# EAGLE design snarfbasebasics232-v02 (EAGLE 5.11)
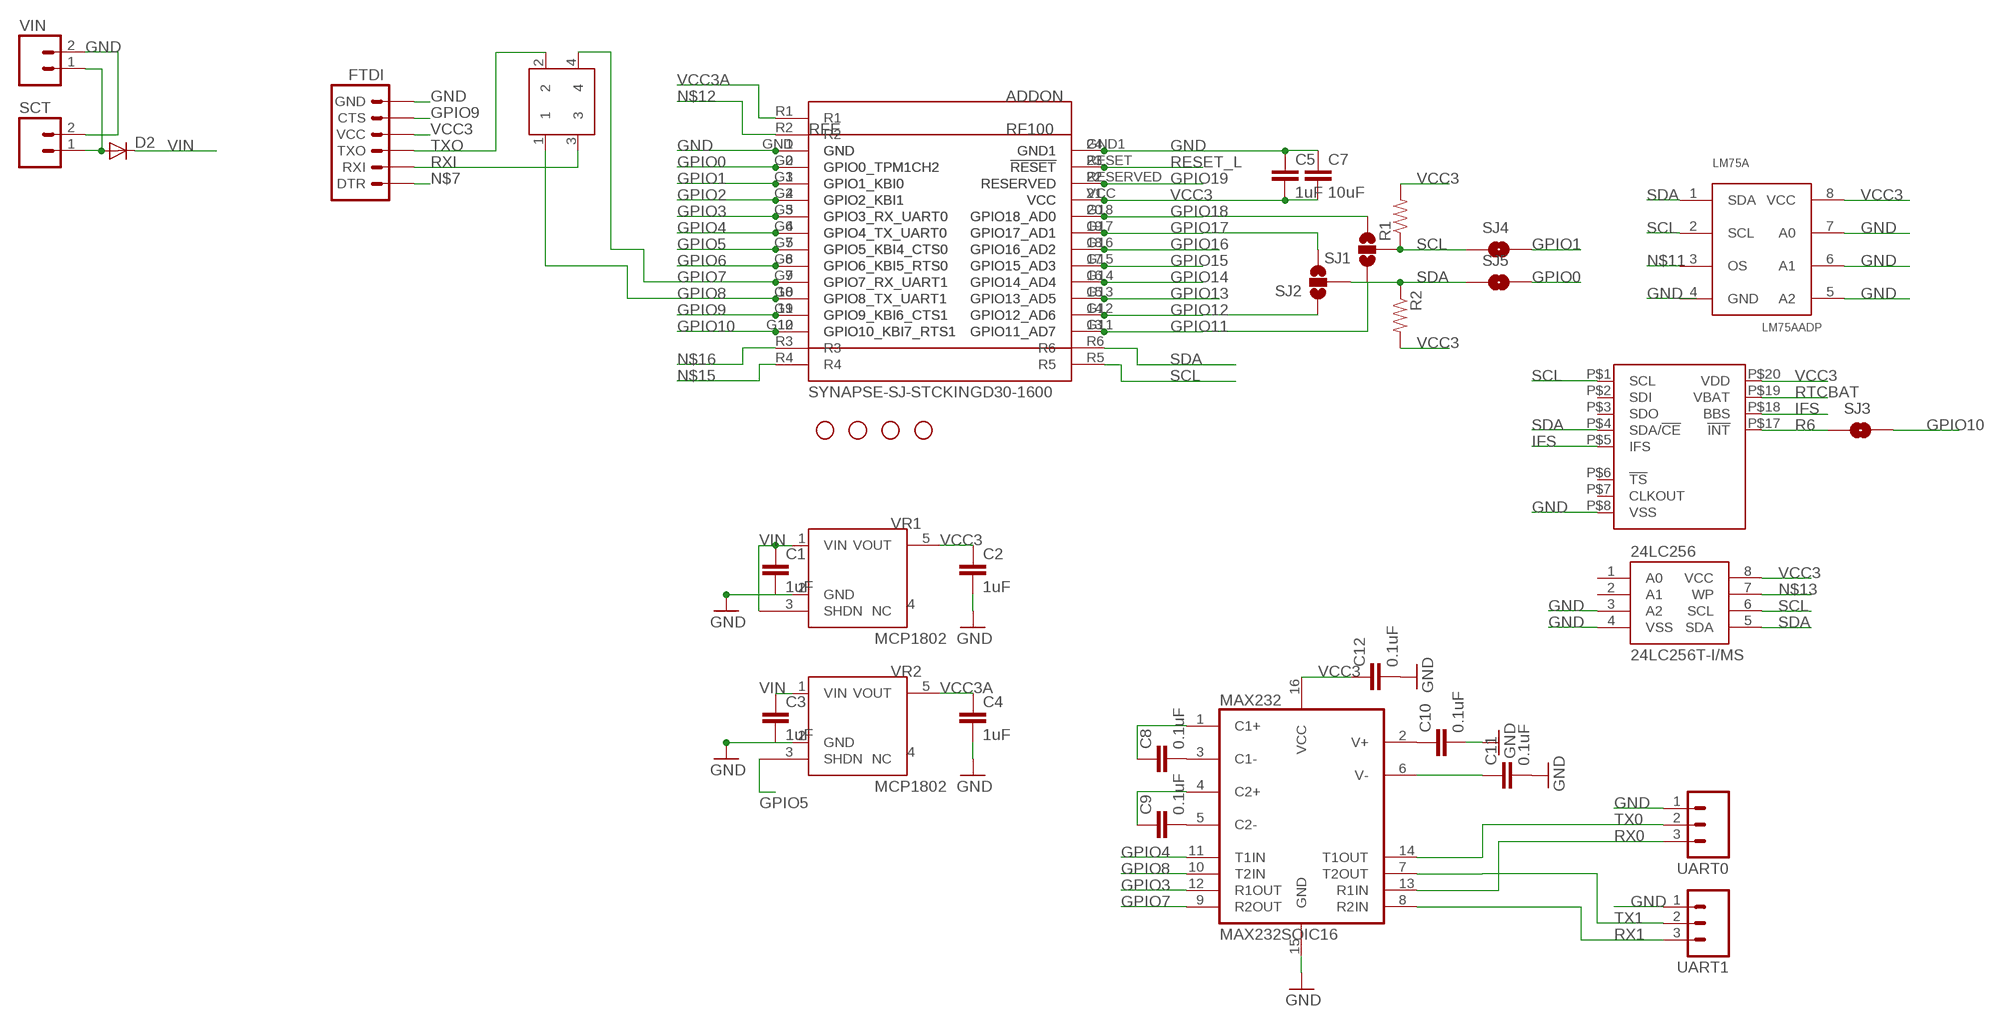
[diagram p0: schematic, sheet 1]

## Parts
24LC256  24LC256T-I/MS  EEPROM-I2CSMD  [SO08]
ADDON  SYNAPSE-SJ-STCKINGD30-1600  [SYNSJ-STACK]
C1  1uF  CAP0805  [0805]
C2  1uF  CAP0805  [0805]
C3  1uF  CAP0805  [0805]
C4  1uF  CAP0805  [0805]
C5  1uF  CAP0805  [0805]
C7  10uF  CAP0805  [0805]
C8  0.1uF  CAP0805  [0805]
C9  0.1uF  CAP0805  [0805]
C10  0.1uF  CAP0805  [0805]
C11  0.1uF  CAP0805  [0805]
C12  0.1uF  CAP0805  [0805]
D2  DIODESMA  [SMA-DIODE]
FTDI  ARDUINO_SERIAL_PROGRAMPTH  [1X06]
JP6  STAND-OFF  [STAND-OFF]
JP9  STAND-OFF  [STAND-OFF]
JP10  STAND-OFF  [STAND-OFF]
JP11  STAND-OFF  [STAND-OFF]
LM75A  LM75AADP  [TSSOP8]
MAX232  MAX232SOIC16  [SO016]
PCF2129A  PCF2129ASO20  [SO20W]
R1  RESISTOR  [0805]
R2  RESISTOR  [0805]
RFE  RFE  SYNAPSEWIRELESS-RFENGINEINNERPADS  [SYNAPSERFENGINE-THM-SMT-JACK]
RXTX  SERIAL_CROSSOVER  [2X02_PTH]
SCT  M023.5MM  [SCREWTERMINAL-3.5MM-2]
SJ1  SOLDERJUMPER_2WAYS  [SJ_3]
SJ2  SOLDERJUMPER_2WAYS  [SJ_3]
SJ3  SOLDERJUMPERNC2  [SJ_2S-NOTRACE]
SJ4  SOLDERJUMPERNO  [SJ_2S-NO]
SJ5  SOLDERJUMPERNO  [SJ_2S-NO]
UART0  M03PTH  [1X03]
UART1  M03PTH  [1X03]
VIN  M02PTH  [1X02]
VR1  MCP1802  [SOT23-5]
VR2  MCP1802  [SOT23-5]

## Nets
GND: 24LC256.3(A2) 24LC256.4(VSS) ADDON.GND ADDON.GND1 C1.2 C2.2 C3.2 C4.2 C5.1 C7.1 C10.2 C11.2 C12.2 FTDI.6(GND) LM75A.5(A2) LM75A.6(A1) LM75A.7(A0) MAX232.15(GND) PCF2129A.P$8(VSS) RFE.1(GND) RFE.24(GND1) SCT.2 UART0.1 UART1.1 VIN.2 VR1.2(GND) VR2.2(GND)
GPIO0: ADDON.G0(GPIO0_TPM1CH2) RFE.2(GPIO0_TPM1CH2) SJ5.2
GPIO1: ADDON.G1(GPIO1_KBI0) RFE.3(GPIO1_KBI0) SJ4.2
GPIO2: ADDON.G2(GPIO2_KBI1) RFE.4(GPIO2_KBI1)
GPIO3: ADDON.G3(GPIO3_RX_UART0) MAX232.12(R1OUT) RFE.5(GPIO3_RX_UART0)
GPIO4: ADDON.G4(GPIO4_TX_UART0) MAX232.11(T1IN) RFE.6(GPIO4_TX_UART0)
GPIO5: ADDON.G5(GPIO5_KBI4_CTS0) RFE.7(GPIO5_KBI4_CTS0) VR2.3(SHDN)
GPIO6: ADDON.G6(GPIO6_KBI5_RTS0) RFE.8(GPIO6_KBI5_RTS0)
GPIO7: ADDON.G7(GPIO7_RX_UART1) MAX232.9(R2OUT) RFE.9(GPIO7_RX_UART1) RXTX.4
GPIO8: ADDON.G8(GPIO8_TX_UART1) MAX232.10(T2IN) RFE.10(GPIO8_TX_UART1) RXTX.1
GPIO9: ADDON.G9(GPIO9_KBI6_CTS1) FTDI.5(CTS) RFE.11(GPIO9_KBI6_CTS1)
GPIO10: ADDON.G10(GPIO10_KBI7_RTS1) RFE.12(GPIO10_KBI7_RTS1) SJ3.2
GPIO11: ADDON.G11(GPIO11_AD7) RFE.13(GPIO11_AD7) SJ1.1
GPIO12: ADDON.G12(GPIO12_AD6) RFE.14(GPIO12_AD6) SJ2.1
GPIO13: ADDON.G13(GPIO13_AD5) RFE.15(GPIO13_AD5)
GPIO14: ADDON.G14(GPIO14_AD4) RFE.16(GPIO14_AD4)
GPIO15: ADDON.G15(GPIO15_AD3) RFE.17(GPIO15_AD3)
GPIO16: ADDON.G16(GPIO16_AD2) RFE.18(GPIO16_AD2)
GPIO17: ADDON.G17(GPIO17_AD1) RFE.19(GPIO17_AD1) SJ2.3
GPIO18: ADDON.G18(GPIO18_AD0) RFE.20(GPIO18_AD0) SJ1.3
GPIO19: ADDON.RESERVED RFE.22(RESERVED)
IFS: PCF2129A.P$5(IFS) PCF2129A.P$18(BBS)
N$1: C8.2 MAX232.3(C1-)
N$2: D2.A SCT.1 VIN.1
N$4: C9.2 MAX232.5(C2-)
N$5: C10.1 MAX232.2(V+)
N$6: C11.1 MAX232.6(V-)
N$7: FTDI.1(DTR)
N$8: C8.1 MAX232.1(C1+)
N$10: C9.1 MAX232.4(C2+)
N$11: LM75A.3(OS)
N$12: ADDON.R2
N$13: 24LC256.7(WP)
N$15: ADDON.R4
N$16: ADDON.R3
R6: PCF2129A.P$17(!INT) SJ3.1
RESET_L: ADDON.RESET(!RESET) RFE.23(!RESET)
RTCBAT: PCF2129A.P$19(VBAT)
RX0: MAX232.13(R1IN) UART0.3
RX1: MAX232.8(R2IN) UART1.3
RXI: FTDI.2(RXI) RXTX.3
SCL: 24LC256.6(SCL) ADDON.R5 LM75A.2(SCL) PCF2129A.P$1(SCL) R1.1 SJ1.2 SJ4.1
SDA: 24LC256.5(SDA) ADDON.R6 LM75A.1(SDA) PCF2129A.P$4(SDA/!CE) R2.1 SJ2.2 SJ5.1
TX0: MAX232.14(T1OUT) UART0.2
TX1: MAX232.7(T2OUT) UART1.2
TXO: FTDI.3(TXO) RXTX.2
VCC3: 24LC256.8(VCC) ADDON.VCC C2.1 C5.2 C7.2 C12.1 FTDI.4(VCC) LM75A.8(VCC) MAX232.16(VCC) PCF2129A.P$20(VDD) R1.2 R2.2 RFE.21(VCC) VR1.5(VOUT)
VCC3A: ADDON.R1 C4.1 VR2.5(VOUT)
VIN: C1.1 C3.1 D2.C VR1.1(VIN) VR1.3(SHDN) VR2.1(VIN)
Unconnected: 24LC256.1(A0) 24LC256.2(A1) LM75A.4(GND) PCF2129A.P$2(SDI) PCF2129A.P$3(SDO) PCF2129A.P$6(!TS) PCF2129A.P$7(CLKOUT) VR1.4(NC) VR2.4(NC)

## Library data of the parts
24LC256 = SparkFun:EEPROM-I2C
ADDON = 0_jc-custom:SYNAPSE-SJ-STCKING: Standard layout for expansion modules using Synapse Wireless boards
C1-C5 C7-C12 = 0_jc-custom:CAP: Capacitor Standard 0603 ceramic capacitor, and 0.1" leaded capacitor.
D2 = SparkFun:DIODE: Diode These are standard reverse protection diodes and small signal diodes. SMA package can handle up to about 1A. SOD-323 can handle about 200mA. What the SOD-323 package when ordering, there are some mfgs out there that are 5-pin packages.
FTDI = SparkFun:ARDUINO_SERIAL_PROGRAM
JP6 JP9-JP11 = SparkFun:STAND-OFF: Stand Off This is the mechanical footprint for a #4 phillips button head screw. Use the keepout ring to avoid running the screw head into surrounding components. SKU : PRT-00447
LM75A = 0_jc-custom:LM75A
MAX232 = SparkFun:MAX232: RS232 Transceiver Very common IC. This is generically called 'MAX232', but works with the 3V equivalent MAX3232 generic ICs. Field tested and mother approved. Spark Fun Electronics SKU : COM-00316 (DIP) and COM-00589 (SMD)
PCF2129A = 0_jc-custom:PCF2129A
R1 R2 = SparkFun:RESISTOR: Resistor Basic schematic elements and footprints for 0603, 1206, and PTH 1/10th watt (small) resistors.
RFE = 0_jc-custom:SYNAPSEWIRELESS-RFENGINE
RXTX = 0_jc-custom:SERIAL_CROSSOVER
SCT VIN = SparkFun:M02: Header 2 Standard 2-pin 0.1" header. Use with straight break away headers (SKU : PRT-00116), right angle break away headers (PRT-00553), swiss pins (PRT-00743), machine pins (PRT-00117), and female headers (PRT-00115). Molex polarized connector foot print use with SKU : PRT-08233 with associated crimp pins and housings.
SJ1 SJ2 = SparkFun:SOLDERJUMPER_2WAY: Solder Jumper 2 way solder jumper
SJ3-SJ5 = SparkFun:SOLDERJUMPER: Solder Jumper Standard SMD solder jumper. Used to automate production. Two varients : Normally Open and Normally Closed are the same, but have different paste layers. NC will have a large amount of paste and should jumper during reflow.
UART0 UART1 = SparkFun:M03: Header 3 Standard 3-pin 0.1" header. Use with straight break away headers (SKU : PRT-00116), right angle break away headers (PRT-00553), swiss pins (PRT-00743), machine pins (PRT-00117), and female headers (PRT-00115). Molex polarized connector foot print use with SKU : PRT-08232 with associated crimp pins and housings.
VR1 VR2 = 0_jc-custom:MCP1802

## Net classes
0 default: width 0.356 mm

## Board
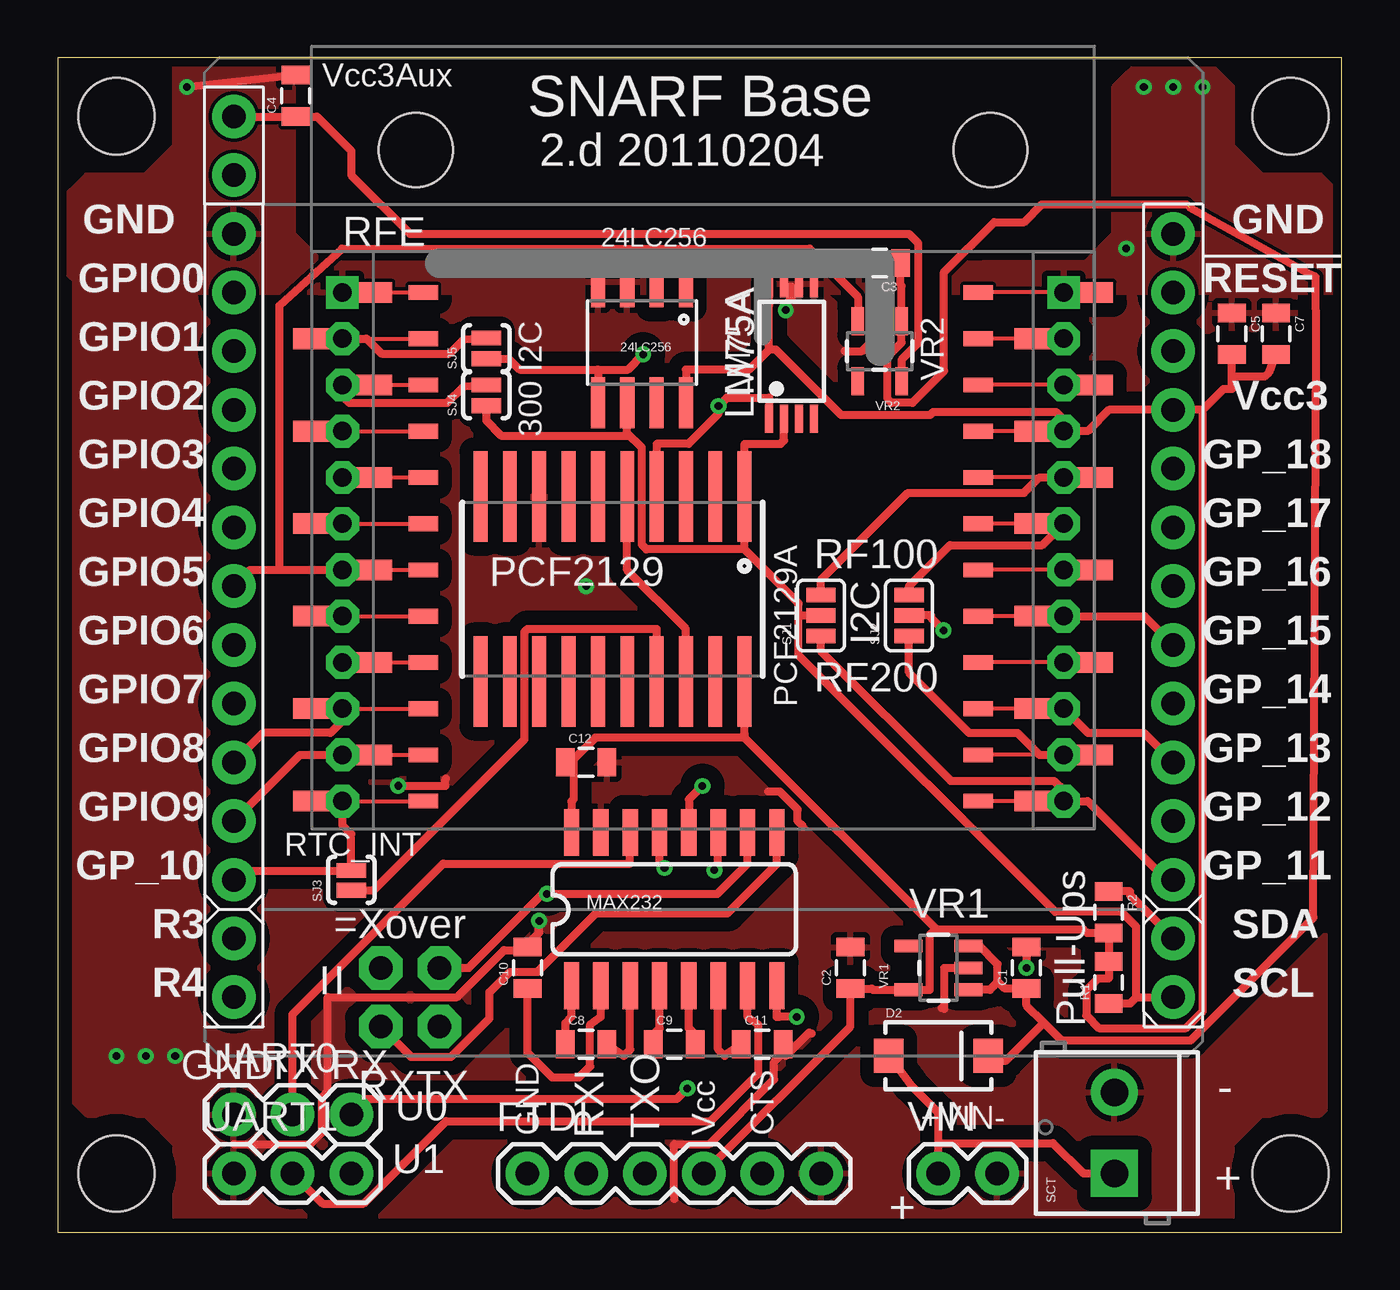
[diagram p1: board, top side]
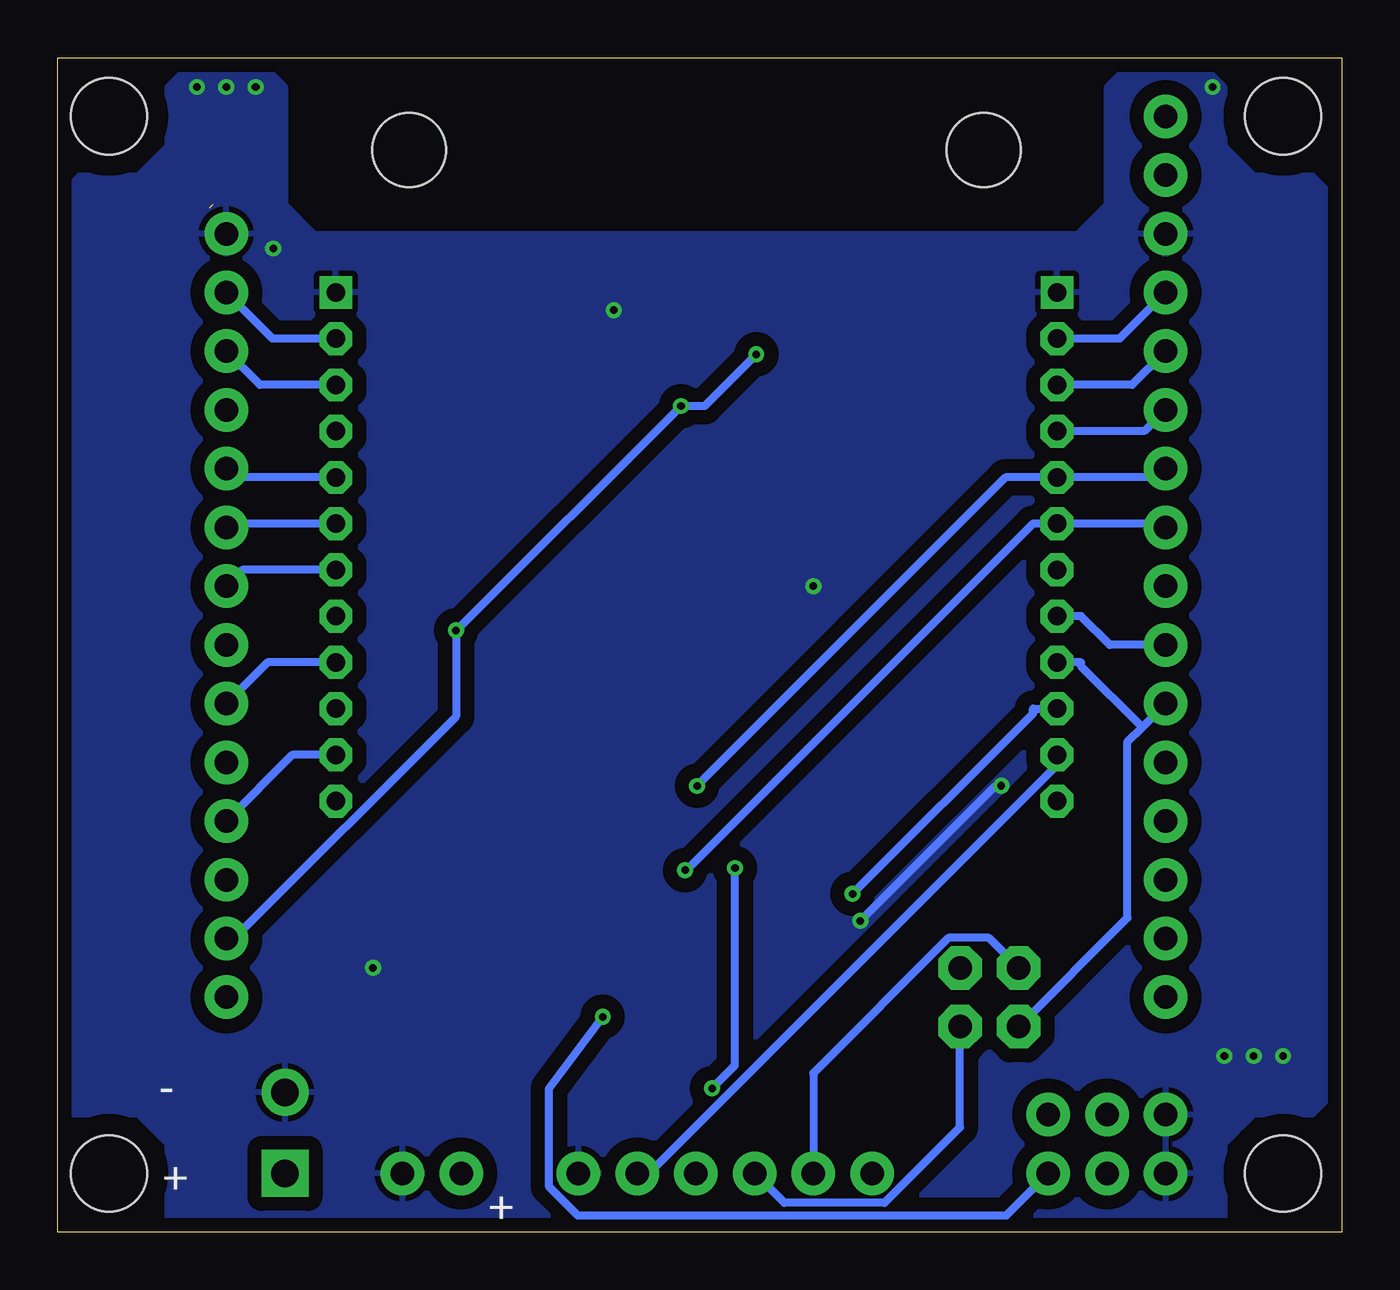
[diagram p2: board, bottom side, seen from below]

Size 55.55 x 50.79 mm. Coordinates in mm from the lower left corner, seen from the top.
Outline: 0,0 55.55,0 55.55,50.79 0,50.79 0,0
Copper layers (1*16): Top 0.0356mm / dielectric 1.5011mm / Bottom 0.0356mm
Design rules "LaenPCBOrder-JCModified": minimum track width 6mil, minimum drill 13mil, track to track 6mil, track to pad 6mil, pad to pad 6mil, via to via 6mil, smd to smd 6mil, copper to edge 15mil, drill to drill 6mil, minimum pad ring 12mil, minimum via ring 7mil, stop-mask expansion 4mil, vias tented up to drill 25mil, thermal gap 10mil

### Footprints (pad centres in the part's own frame; a part is rotated, then mirrored left to right if it is on the bottom)
SO08 = smd 0.61 x 2.21: 1 -1.905,-2.616; 2 -0.635,-2.616; 3 0.635,-2.616; 4 1.905,-2.616; 5 1.905,2.616; 6 0.635,2.616; 7 -0.635,2.616; 8 -1.905,2.616
SYNSJ-STACK = drill 1.016 pad 1.88 round: G0 0,-7.62; G1 0,-10.16; G2 0,-12.7; G3 0,-15.24; G4 0,-17.78; G5 0,-20.32; G6 0,-22.86; G7 0,-25.4; G8 0,-27.94; G9 0,-30.48; G10 0,-33.02; G11 40.64,-33.02; G12 40.64,-30.48; G13 40.64,-27.94; G14 40.64,-25.4; G15 40.64,-22.86; G16 40.64,-20.32; G17 40.64,-17.78; G18 40.64,-15.24; GND 0,-5.08; GND1 40.64,-5.08; R1 0,0; R2 0,-2.54; R3 0,-35.56; R4 0,-38.1; R5 40.64,-38.1; R6 40.64,-35.56; RESERVED 40.64,-10.16; RESET 40.64,-7.62; VCC 40.64,-12.7
0805 = smd 0.8 x 1.2: 1 -0.9,0; 2 0.9,0
SMA-DIODE = smd 1.27 x 1.47: A -2.15,0; C 2.15,0
1X06 = drill 1.016 pad 1.88 round: 1 0,0; 2 2.54,0; 3 5.08,0; 4 7.62,0; 5 10.16,0; 6 12.7,0
STAND-OFF = hole 3.302: 0,0
TSSOP8 = smd 1.2 x 0.35: 1 -2.925,0.975; 2 -2.925,0.325; 3 -2.925,-0.325; 4 -2.925,-0.975; 5 2.925,-0.975; 6 2.925,-0.325; 7 2.925,0.325; 8 2.925,0.975
SO016 = smd 0.66 x 2.032: 1 -4.445,-3.315; 2 -3.175,-3.315; 3 -1.905,-3.315; 4 -0.635,-3.315; 5 0.635,-3.315; 6 1.905,-3.315; 7 3.175,-3.315; 8 4.445,-3.315; 9 4.445,3.315; 10 3.175,3.315; 11 1.905,3.315; 12 0.635,3.315; 13 -0.635,3.315; 14 -1.905,3.315; 15 -3.175,3.315; 16 -4.445,3.315
SO20W = smd 0.6 x 3.9: P$1 -5.715,-4; P$2 -4.445,-4; P$3 -3.175,-4; P$4 -1.905,-4; P$5 -0.635,-4; P$6 0.635,-4; P$7 1.905,-4; P$8 3.175,-4; P$9 4.445,-4; P$10 5.715,-4; P$11 5.715,4; P$12 4.445,4; P$13 3.175,4; P$14 1.905,4; P$15 0.635,4; P$16 -0.635,4; P$17 -1.905,4; P$18 -3.175,4; P$19 -4.445,4; P$20 -5.715,4
SYNAPSERFENGINE-THM-SMT-JACK = drill 0.8 square: 1 0,0; 24 31.2,0 | drill 0.8 pad 1.422 octagon: 2 0,-2; 3 0,-4; 4 0,-6; 5 0,-8; 6 0,-10; 7 0,-12; 8 0,-14; 9 0,-16; 10 0,-18; 11 0,-20; 12 0,-22; 13 31.2,-22; 14 31.2,-20; 15 31.2,-18; 16 31.2,-16; 17 31.2,-14; 18 31.2,-12; 19 31.2,-10; 20 31.2,-8; 21 31.2,-6; 22 31.2,-4; 23 31.2,-2 | smd 1.67 x 0.89: P1 1.3,0; P2 -1.3,-2; P3 1.3,-4; P4 -1.3,-6; P5 1.3,-8; P6 -1.3,-10; P7 1.3,-12; P8 -1.3,-14; P9 1.3,-16; P10 -1.3,-18; P11 1.3,-20; P12 -1.3,-22; P13 29.9,-22; P14 32.5,-20; P15 29.9,-18; P16 32.5,-16; P17 29.9,-14; P18 32.5,-12; P19 29.9,-10; P20 32.5,-8; P21 29.9,-6; P22 32.5,-4; P23 29.9,-2; P24 32.5,0 | smd 1.27 x 0.635: P$1 3.5,0; P$2 3.5,-2; P$3 3.5,-4; P$4 3.5,-6; P$5 3.5,-8; P$6 3.5,-10; P$7 3.5,-12; P$8 3.5,-14; P$9 3.5,-16; P$10 3.5,-18; P$11 3.5,-20; P$12 3.5,-22; P$13 27.5,0; P$14 27.5,-2; P$15 27.5,-4; P$16 27.5,-6; P$17 27.5,-8; P$18 27.5,-10; P$19 27.5,-12; P$20 27.5,-14; P$21 27.5,-16; P$22 27.5,-18; P$23 27.5,-20; P$24 27.5,-22 | hole 3.2: 3.17,6.16; 28.03,6.16
2X02_PTH = drill 1.016 pad 1.88 octagon: 1 -1.27,-1.27; 2 -1.27,1.27; 3 1.27,-1.27; 4 1.27,1.27
SCREWTERMINAL-3.5MM-2 = drill 1.2 pad 2.032 square: 1 0,0 | drill 1.2 pad 2.032 round: 2 3.5,0
SJ_3 = smd 0.635 x 1.27: 1 -0.889,0; 2 0,0; 3 0.889,0
SJ_2S-NOTRACE = smd 0.635 x 1.27: 1 -0.45,0; 2 0.4,0
SJ_2S-NO = smd 0.635 x 1.27: 1 -0.45,0; 2 0.45,0
1X03 = drill 1.016 pad 1.88 round: 1 0,0; 2 2.54,0; 3 5.08,0
1X02 = drill 1.016 pad 1.88 round: 1 0,0; 2 2.54,0
SOT23-5 = smd 0.55 x 1.2: 1 -0.95,-1.3; 2 0,-1.3; 3 0.95,-1.3; 4 0.95,1.3; 5 -0.95,1.3

### Placement (x,y rotation side)
24LC256  25.27,38.48 180 top
ADDON  7.62,48.26 0 top
C1  41.91,11.43 90 top
C2  34.29,11.43 90 top
C3  35.56,41.91 180 top
C4  10.29,49.15 90 top
C5  50.8,38.86 270 top
C7  52.7,38.86 270 top
C8  22.86,8.13 0 top
C9  26.67,8.13 0 top
C10  20.32,11.43 90 top
C11  30.48,8.13 0 top
C12  22.86,20.32 0 top
D2  38.1,7.62 0 top
FTDI  20.32,2.54 0 top
JP6  53.34,2.54 0 top
JP9  2.54,2.54 0 top
JP10  53.34,48.26 0 top
JP11  2.54,48.26 0 top
LM75A  31.75,38.1 90 top
MAX232  26.67,13.97 0 top
PCF2129A  24,27.81 180 top
R1  45.47,10.79 90 top
R2  45.47,13.84 270 top
RFE  12.32,40.64 0 top
RXTX  15.24,10.16 180 top
SCT  45.72,2.54 90 top
SJ1  33.02,26.67 90 top
SJ2  36.83,26.67 90 top
SJ3  12.7,15.24 90 top
SJ4  18.54,36.2 90 top
SJ5  18.54,38.23 90 top
UART0  7.62,5.08 0 top
UART1  7.62,2.54 0 top
VIN  38.1,2.54 0 top
VR1  38.1,11.43 90 top
VR2  35.56,38.1 180 top

### Tracks (layer width: path | path; a pad name or v marks a point on that pad's centre or on a via)
GND  (via drill 0.33, 0.33 pad 0.69)
  Top 0.356: 32.62,8.59 32.51,8.64 31.5,7.62 C11.2 31.24,7.62 30.99,7.37 30.99,6.6 28.19,3.81 26.67,3.81 26.67,1.52 26.67,1.44 | 32.26,17.53 32,17.78 32,18.29 31.24,19.05 30.73,19.05 | 35.56,40.64 35.56,39.62 VR2.2 35.56,39.37 35.31,39.12 35.31,38.61 34.8,38.1 34.04,38.1 | VR1.2 39.37,11.43 38.35,11.43 38.35,9.65 38.25,9.71 | 7.62,3.81 10.92,3.81 11.43,4.32 11.43,5.84 11.68,6.1 11.68,10.16 17.27,10.16 19.3,12.19 20.32,12.19 C10.2 20.32,12.45 20.83,12.95 v20.83,13.46 | v41.91,11.43 41.91,12.19 C1.2 | v31.5,39.88 31.5,40.13 31.75,40.39 31.75,40.89 31.5,40.89 LM75A.7 | v14.73,19.3 16.76,19.3 16.76,19.56 16.79,19.62 | v5.59,49.53 C4.2
  Bottom 0.356: v20.83,13.46 14.99,19.3 v14.73,19.3
  other vias: 46.99,49.53 48.26,49.53 49.53,49.53 46.23,42.55 2.54,7.62 3.81,7.62 5.08,7.62 22.86,27.94
  pour Top (isolate 0.61): 0,41.91 0,6.35 1.27,5.08 3.81,5.08 5.08,3.81 5.08,0 50.8,0 50.8,3.81 52.07,5.08 54.61,5.08 55.88,6.35 55.88,41.91
  pour Top: 0,41.91 0,44.45 1.27,45.72 3.81,45.72 5.08,46.99 5.08,50.8 8.89,50.8 10.16,49.53 10.16,43.18 11.43,41.91 44.45,41.91 45.72,43.18 45.72,49.53 46.99,50.8 49.53,50.8 50.8,49.53 50.8,46.99 52.07,45.72 54.61,45.72 55.88,44.45 55.88,40.64 1.27,40.64
  pour Bottom (isolate 0.61): 0,44.45 0,6.35 1.27,5.08 3.81,5.08 5.08,3.81 5.08,0 50.8,0 50.8,3.81 52.07,5.08 55.88,5.08 55.88,44.45 54.61,45.72 52.07,45.72 50.8,46.99 50.8,49.53 49.53,50.8 46.99,50.8 45.72,49.53 45.72,44.45 44.45,43.18 11.43,43.18 10.16,44.45 10.16,49.53 8.89,50.8 6.35,50.8 5.08,49.53 5.08,46.99 3.81,45.72 1.27,45.72
GPIO0
  Top 0.356: RFE.2 13.36,38.64 14.01,37.99 16.94,37.99 17.58,38.63 SJ5.2
  Bottom 0.356: RFE.2 9.62,38.64 ADDON.G0
GPIO1
  Top 0.356: SJ4.2 17.58,36.59 16.85,35.87 12.61,35.87 12.32,36.16 RFE.3
  Bottom 0.356: RFE.3 9.08,36.64 ADDON.G1
GPIO2
  Bottom 0.356: RFE.4 8.54,34.64 ADDON.G2
GPIO3  (via drill 0.33 pad 0.69)
  Top 0.356: v27.89,19.3 27.3,18.71 MAX232.12
  Bottom 0.356: v27.89,19.3 14.55,32.64 RFE.5 8,32.64 ADDON.G3
GPIO4  (via drill 0.33 pad 0.69)
  Top 0.356: v28.41,15.66 28.57,15.83 MAX232.11
  Bottom 0.356: v28.41,15.66 28.34,15.66 13.36,30.64 RFE.6 7.78,30.64 ADDON.G4
GPIO5
  Top 0.356: 9.6,28.64 8.32,28.64 ADDON.G5 | 9.6,28.64 RFE.7 | VR2.3 34.61,40.45 32.53,42.53 12.3,42.53 9.6,40.09 9.6,28.64
GPIO6
  Bottom 0.356: RFE.8 11.28,26.64 10.04,25.4 ADDON.G6
GPIO7
  Top 0.356: MAX232.9 31.11,15.94 28.97,13.79 23.29,13.79 20.76,11.26 19.56,11.26 18.68,10.38 18.68,9.24 17.02,7.58 15.28,7.58 RXTX.4
  Bottom 0.356: RFE.9 11.28,24.64 11.28,24.48 8.64,21.84 | 8.64,21.84 ADDON.G7 | RXTX.4 9.27,13.59 9.27,21.21 8.64,21.84
GPIO8  (via drill 0.33 pad 0.69)
  Top 0.356: MAX232.10 29.84,15.94 28.54,14.63 v21.16,14.63 20.98,14.63 17.78,11.43 RXTX.1 | RFE.10 12.32,22.11 11.8,21.59 8.89,21.59 ADDON.G8
  Bottom 0.356: RFE.10 13.36,22.64 13.36,22.43 v21.16,14.63
GPIO9
  Top 0.356: RFE.11 10.48,20.64 ADDON.G9
  Bottom 0.356: RFE.11 12.32,20.19 29.97,2.54 FTDI.5
GPIO10
  Top 0.356: RFE.12 12.32,17.6 12.7,17.22 SJ3.2 8.02,15.64 ADDON.G10
GPIO11
  Top 0.356: SJ1.1 33.02,25.13 38.64,19.52 43.11,19.52 43.52,19.1 RFE.13 44.56,18.64 47.96,15.24 ADDON.G11
GPIO12
  Top 0.356: RFE.14 42.48,20.64 41.52,21.6 39.43,21.6 36.83,24.2 36.83,25.13 SJ2.1
  Bottom 0.356: RFE.14 45.4,20.64 ADDON.G12
GPIO13
  Top 0.356: RFE.15 44.57,21.59 46.99,21.59 ADDON.G13
GPIO14
  Bottom 0.356: RFE.16 46.48,24.64 ADDON.G14
GPIO15
  Top 0.356: RFE.17 47.02,26.64 ADDON.G15
GPIO16
  Bottom 0.356: RFE.18 47.56,28.64 ADDON.G16
GPIO17
  Top 0.356: SJ2.3 36.83,27.94 38.1,29.21 38.61,29.72 42.6,29.72 RFE.19
  Bottom 0.356: RFE.19 48.1,30.64 ADDON.G17
GPIO18
  Top 0.356: RFE.20 42.48,32.64 41.81,31.97 36.78,31.97 33.02,28.21 SJ1.3
  Bottom 0.356: RFE.20 47.88,32.64 ADDON.G18
GPIO19
  Bottom 0.356: RFE.22 46.8,36.64 ADDON.RESERVED
IFS
  Top 0.356: PCF2129A.P$18 27.18,26.09 24.64,28.63 PCF2129A.P$5
N$1
  Top 0.356: C8.2 24.49,7.62 24.77,7.89 MAX232.3
N$2
  Top 0.356: 38.1,3.85 38.1,5.17 36.91,6.35 D2.A | VIN.1 38.1,3.85 | 38.1,3.85 43.06,3.85 44.37,2.54 SCT.1
N$4
  Top 0.356: C9.2 27.57,8.55 27.3,8.81 MAX232.5
N$5
  Top 0.356: MAX232.2 23.5,9.31 23.03,8.97 23.03,7.17 22.55,6.69 21.39,6.69 20.32,7.76 C10.1
N$6
  Top 0.356: C11.1 28.85,7.62 28.57,7.89 MAX232.6
N$8
  Top 0.356: MAX232.1 22.23,9.31 21.96,9.04 C8.1
N$10
  Top 0.356: C9.1 25.77,8.55 26.04,8.81 MAX232.4
R6
  Top 0.356: PCF2129A.P$17 25.91,26.09 20.32,26.09 20.19,25.96 20.19,21.31 13.66,14.79 SJ3.1
RESET_L
  Bottom 0.356: RFE.23 46.26,38.64 ADDON.RESET
RX0  (via drill 0.33 pad 0.69)
  Top 0.356: UART0.3 13.38,5.76 26.79,5.76 v27.24,6.22 | MAX232.13 26.04,15.94 26.06,15.94 v26.25,15.75
  Bottom 0.356: v26.25,15.75 26.25,7.21 v27.24,6.22
RX1  (via drill 0.33 pad 0.69)
  Top 0.356: MAX232.8 31.11,9.31 31.21,9.31 v31.97,9.31
  Bottom 0.356: UART1.3 14.53,0.71 33.05,0.71 34.29,1.96 34.29,6.23 v31.97,9.31
RXI
  Bottom 0.356: RXTX.3 15.27,12.73 17.02,12.73 22.86,6.88 FTDI.2
SCL
  Top 0.356: 46.66,10.16 46.4,9.89 R1.1 | 46.66,10.16 ADDON.R5 | 46.66,10.16 46.66,13.22 46.02,13.85 43.15,13.85 32.05,24.95 32.05,26.67 | 32.05,26.67 SJ1.2 | 32.05,26.67 32.05,27.2 29.72,29.53 | 29.72,29.53 PCF2129A.P$1 29.72,34.09 31.27,34.09 31.43,34.24 LM75A.2 | 24.64,34.56 25.27,33.93 25.27,29.73 25.47,29.53 29.72,29.53 | 24.64,34.56 24.64,34.43 19.21,34.43 18.54,35.1 SJ4.1 | 24.64,34.56 24LC256.6
SDA  (via drill 0.33 pad 0.69)
  Top 0.356: 23.37,37.3 24.66,37.3 v25.33,37.97 | 23.37,37.3 19.98,37.3 19.51,37.78 SJ5.1 | LM75A.1 30.77,36.09 28.95,36.09 v28.58,35.73 28.58,35.38 27.29,34.09 25.91,34.09 PCF2129A.P$4 | 23.37,37.3 24LC256.5 | R2.1 46.4,14.74 46.4,14.56 ADDON.R6 | SJ2.2 37.8,26.67 37.8,26.56 v38.33,26.03
  Bottom 0.356: v25.33,37.97 27.57,35.73 v28.58,35.73 38.29,26.03 v38.33,26.03 38.33,22.3 47.92,12.7 ADDON.R6
TX0
  Top 0.356: MAX232.14 24.77,15.94 16.68,15.94 10.16,9.42 UART0.2
TX1
  Top 0.356: MAX232.7 29.84,9.31 30.31,8.97 30.31,6.86 28.25,4.8 16.8,4.8 13.23,1.24 11.46,1.24 UART1.2
TXO
  Bottom 0.356: RXTX.2 16.51,4.53 19.78,1.26 24.12,1.26 FTDI.3
VCC3
  Top 0.356: 29.72,21.39 23.26,21.39 22.32,20.46 22.32,20.32 | 37.97,13.1 37.97,13.14 29.72,21.39 | 29.72,21.39 29.72,21.53 PCF2129A.P$20 | 37.97,13.1 37.73,12.86 37.73,10.48 VR1.5 35.27,10.48 35.22,10.53 C2.1 34.29,8.89 FTDI.4 | 37.97,13.1 44.38,13.1 44.54,12.94 R2.2 R1.2 45.47,10.96 45.01,10.96 44.5,10.46 44.5,9.38 45.05,8.83 48.81,8.83 49.53,9.55 49.53,35.56 | MAX232.16 22.23,18.63 22.32,18.73 22.32,20.32 | 22.32,20.32 C12.1 | 30.77,38.17 29.91,37.3 27.18,37.3 24LC256.8 | 30.77,38.17 30.77,40.09 LM75A.8 | 44.03,34.64 43.2,35.47 37.87,35.47 37.74,35.33 33.9,35.33 31.06,38.17 30.77,38.17 | 44.03,34.64 RFE.21 | 44.03,34.64 44.04,34.64 44.56,34.64 45.48,35.56 ADDON.VCC 49.53,35.56 | C7.2 52.41,37.2 52.22,37.01 50.8,37.01 | 50.8,37.01 50.8,36.47 50.44,36.47 49.53,35.56 | 50.8,37.01 C5.2
VCC3A
  Top 0.356: VR2.5 36.51,37.73 37.22,38.44 37.22,42.66 37.22,42.79 36.83,43.18 15.24,43.18 12.7,45.72 12.7,46.77 11.22,48.25 C4.1 ADDON.R1
VIN  (1 unrouted)
  Top 0.356: D2.C 40.25,7.42 41.03,7.42 42.66,9.05 | 42.66,9.05 41.91,9.8 C1.1 40.98,10.53 40.7,10.8 40.66,10.8 | 48.83,44.45 42.58,44.45 41.81,43.69 40.51,43.69 38.35,41.52 38.35,37.24 36.98,35.87 36.08,35.87 35.9,36.05 35.9,37.86 36.51,38.47 VR2.1 36.51,40.93 36.46,40.98 C3.1 | 48.98,44.3 54.13,41.45 54.42,41.32 54.45,38.49 54.32,13.6 49.02,8.3 43.41,8.3 42.66,9.05 | 40.66,10.8 40.33,10.48 VR1.1 | 40.66,10.8 40.66,11.59 39.87,12.38 VR1.3

### Text on the board
tPlace: Vcc3Aux | SNARF Base | 2.d 20110204 | GND | 24LC256 | GND | GPIO0 | LM75A | !RESET | GPIO1 | GPIO2 | VR2 | Vcc3 | GPIO3 | 300 I2C | GP_18 | GPIO4 | RF100 | GP_17 | GPIO5 | PCF2129 | GP_16 | GPIO6 | I2C | RF200 | GP_15 | GPIO7 | GP_14 | GPIO8 | GP_13 | GPIO9 | GP_12 | GP_10 | RTC_INT | GP_11 | R3 | VR1 | =Xover | SDA | R4 | = | SCL | Pull-Ups | GND | TX | RX | - | U0 | GND | RXI | TXO | Vcc | CTS | +VIN- | U1 | + | +
bPlace: - | + | +